# Altium schematic sheet clear.SchDoc
size A4
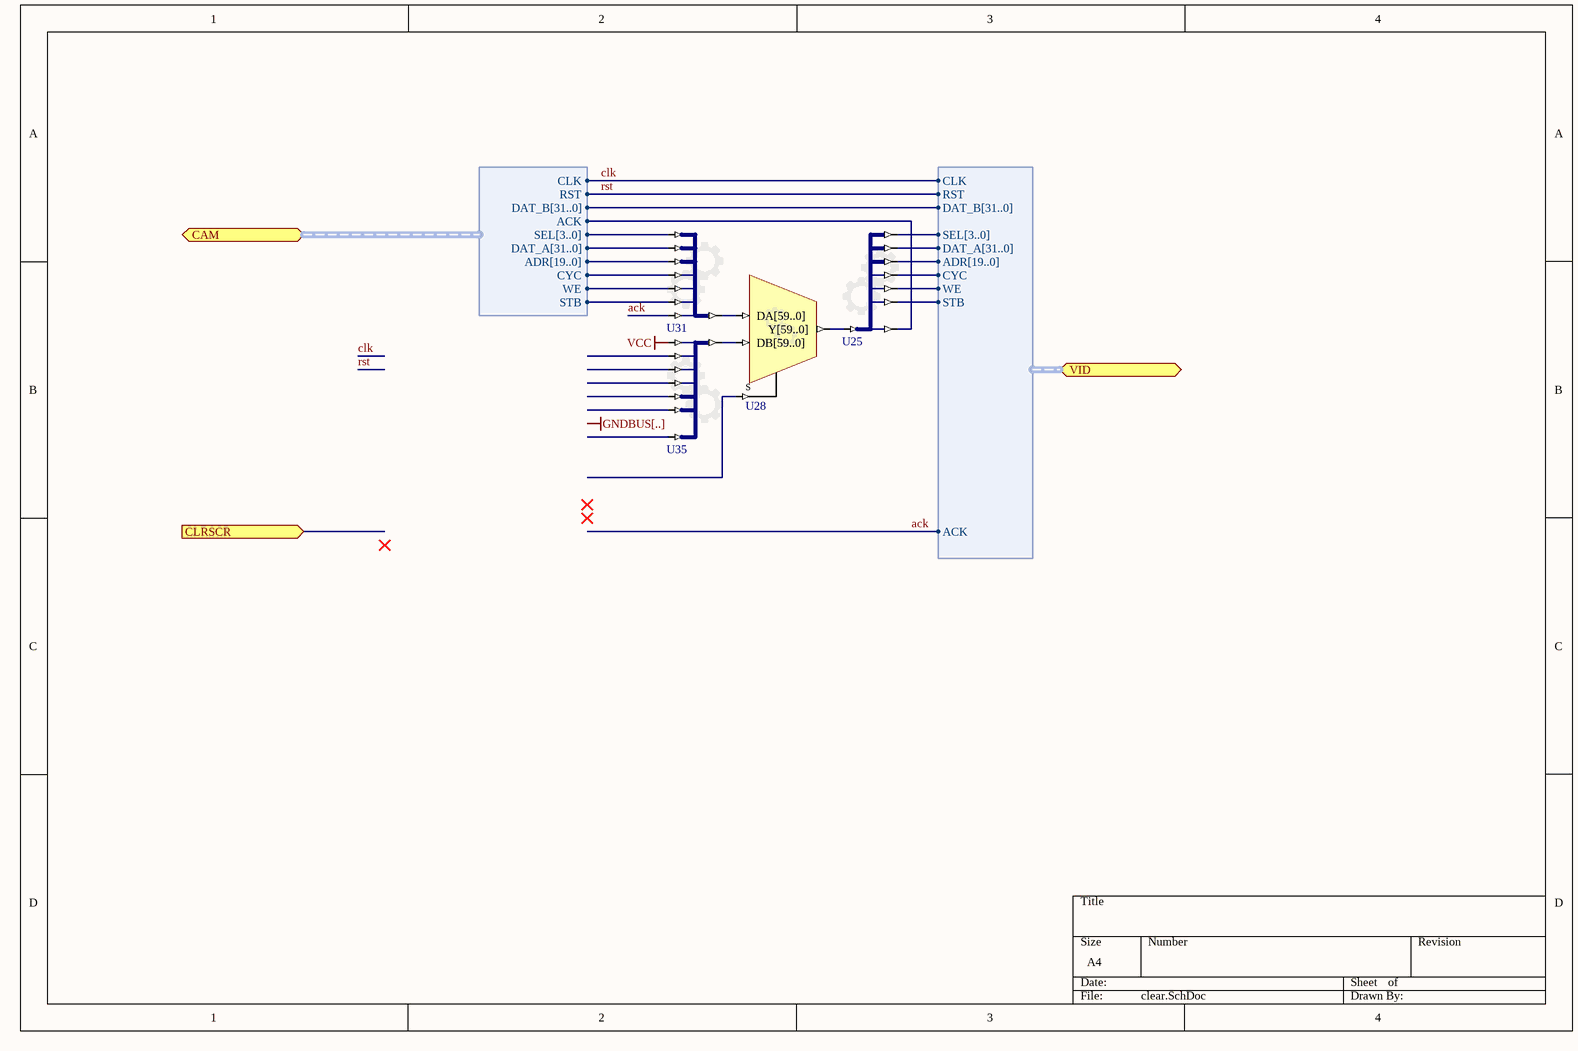
[diagram p0: clear.SchDoc]

## Parts
U25  BUS_JS  (value not drawn)
U28  MUX  (value not drawn)
U31  BUS_JS  (value not drawn)
U35  BUS_JS  (value not drawn)

## Ports
CAM (harness H_WB), CLRSCR (in), VID (harness H_WB)

## Harnesses
H_WB: STB, CYC, ACK, ADR[19..0], DAT_A[31..0], DAT_B[31..0], SEL[3..0], WE, CLK, RST
H_WB: STB, CYC, ACK, ADR[19..0], DAT_A[31..0], SEL[3..0], CLK, RST, DAT_B[31..0], WE

## Nets
VCC: U35.I0
ack: U31.I0 ; port VID.ACK
clk: port CAM.CLK, port VID.CLK
rst: port CAM.RST, port VID.RST
NetU25_I[59..0]: U25.I[59..0] U28.Y[59..0]
NetU25_O0: U25.O0 ; port CAM.ACK
NetU25_O1: U25.O1 ; port VID.STB
NetU25_O2: U25.O2 ; port VID.WE
NetU25_O3: U25.O3 ; port VID.CYC
NetU25_O4_B[19..0]: U25.O4_B[19..0] ; port VID.ADR[19..0]
NetU25_O5_B[31..0]: U25.O5_B[31..0] ; port VID.DAT_A[31..0]
NetU25_O6_B[3..0]: U25.O6_B[3..0] ; port VID.SEL[3..0]
NetU28_DA[59..0]: U28.DA[59..0] U31.O[59..0]
NetU28_DB[59..0]: U28.DB[59..0] U35.O[59..0]
NetU31_I1: U31.I1 ; port CAM.STB
NetU31_I2: U31.I2 ; port CAM.WE
NetU31_I3: U31.I3 ; port CAM.CYC
NetU31_I4_B[19..0]: U31.I4_B[19..0] ; port CAM.ADR[19..0]
NetU31_I5_B[31..0]: U31.I5_B[31..0] ; port CAM.DAT_A[31..0]
NetU31_I6_B[3..0]: U31.I6_B[3..0] ; port CAM.SEL[3..0]

Not connected (* = marked no-connect by the designer): U28 S; U35 I1 I2 I3 I4_B[19..0] I5_B[31..0] I6_B[3..0]

## Notes on the sheet
- Labels drawn without touching a wire or pin: GNDBUS[..]

## Library data of the parts
U25 = BUS_JS: Configurable Bus Joiner/Splitter; ConfiguratorName: GENERIC_BUS_JS; ConfigurationParameters: {}Version[1.1]{}SplitterJoinerType[Splitter]{}SignalCount[7]{}SignalWidth0[1]{}GapBelow0[2000000]{}ConnectionType0[Pin]{}SignalWidth1[1]{}GapBelow1[1000000]{}ConnectionType1[Pin]{}SignalWidth2[1]{}GapBelow2[1000000]{}ConnectionType2[Pin]{}SignalWidth3[1]{}GapBelow3[1000000]{}ConnectionType3[Pin]{}SignalWidth4[20]{}GapBelow4[1000000]{}ConnectionType4[Pin]{}SignalWidth5[32]{}GapBelow5[1000000]{}ConnectionType5[Pin]{}SignalWidth6[4]{}GapBelow6[1000000]{}ConnectionType6[Pin]{}ShowPinNames[False]{}; LastRevisionNo: 1.00.00; Published: 17-Sep-2008; Publisher: Altium Limited; HelpURL: https://wiki.altium.com/display/ADOH/Configurable+Generic+Library
U28 = MUX: Configurable Mutliplexer; ConfigurationParameters: {}Version[1.0]{}ShowEnable[False]{}BusInputs[True]{}BusOutputs[True]{}SignalWidth[60]{}Type[Multiplexer]{}RegisterOutputs[False]{}NegativeClockEdge[False]{}ShowPinNames[True]{}InvertSingleSignal[False]{}SignalCount[2]{}Invert0[False]{}Invert1[False]{}; ConfiguratorName: GENERIC_MULTIPLEXER; LastRevisionNo: 1.00.00; Published: 31-Dec-2008; Publisher: Altium Limited
U31 = BUS_JS: Configurable Bus Joiner/Splitter; ConfiguratorName: GENERIC_BUS_JS; ConfigurationParameters: {}Version[1.1]{}SplitterJoinerType[Joiner]{}SignalCount[7]{}SignalWidth0[1]{}GapBelow0[1000000]{}ConnectionType0[Pin]{}SignalWidth1[1]{}GapBelow1[1000000]{}ConnectionType1[Pin]{}SignalWidth2[1]{}GapBelow2[1000000]{}ConnectionType2[Pin]{}SignalWidth3[1]{}GapBelow3[1000000]{}ConnectionType3[Pin]{}SignalWidth4[20]{}GapBelow4[1000000]{}ConnectionType4[Pin]{}SignalWidth5[32]{}GapBelow5[1000000]{}ConnectionType5[Pin]{}SignalWidth6[4]{}GapBelow6[1000000]{}ConnectionType6[Pin]{}ShowPinNames[False]{}; LastRevisionNo: 1.00.00; Published: 17-Sep-2008; Publisher: Altium Limited; HelpURL: https://wiki.altium.com/display/ADOH/Configurable+Generic+Library
U35 = BUS_JS: Configurable Bus Joiner/Splitter; ConfiguratorName: GENERIC_BUS_JS; ConfigurationParameters: {}Version[1.1]{}SplitterJoinerType[Joiner]{}SignalCount[7]{}SignalWidth0[1]{}GapBelow0[1000000]{}ConnectionType0[Pin]{}SignalWidth1[1]{}GapBelow1[1000000]{}ConnectionType1[Pin]{}SignalWidth2[1]{}GapBelow2[1000000]{}ConnectionType2[Pin]{}SignalWidth3[1]{}GapBelow3[1000000]{}ConnectionType3[Pin]{}SignalWidth4[20]{}GapBelow4[1000000]{}ConnectionType4[Pin]{}SignalWidth5[32]{}GapBelow5[2000000]{}ConnectionType5[Pin]{}SignalWidth6[4]{}GapBelow6[1000000]{}ConnectionType6[Pin]{}ShowPinNames[False]{}; LastRevisionNo: 1.00.00; Published: 17-Sep-2008; Publisher: Altium Limited; HelpURL: https://wiki.altium.com/display/ADOH/Configurable+Generic+Library